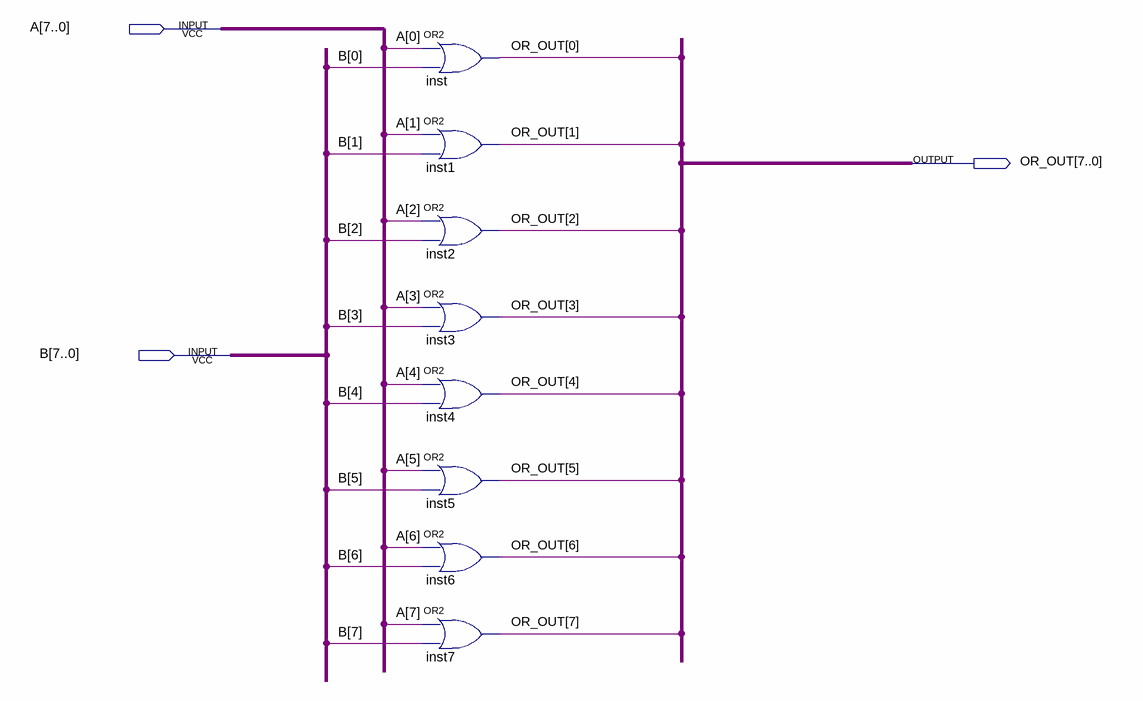
[diagram p0: schematic sheet]
// Quartus schematic OR-PJ2.bdf as structural Verilog: 8 symbols, 3 pins
module \OR-PJ2  (
  input  [7:0] A,
  input  [7:0] B,
  output [7:0] OR_OUT
);

  or inst (OR_OUT[0], A[0], B[0]);
  or inst1 (OR_OUT[1], A[1], B[1]);
  or inst2 (OR_OUT[2], A[2], B[2]);
  or inst3 (OR_OUT[3], A[3], B[3]);
  or inst4 (OR_OUT[4], A[4], B[4]);
  or inst5 (OR_OUT[5], A[5], B[5]);
  or inst6 (OR_OUT[6], A[6], B[6]);
  or inst7 (OR_OUT[7], A[7], B[7]);
endmodule
